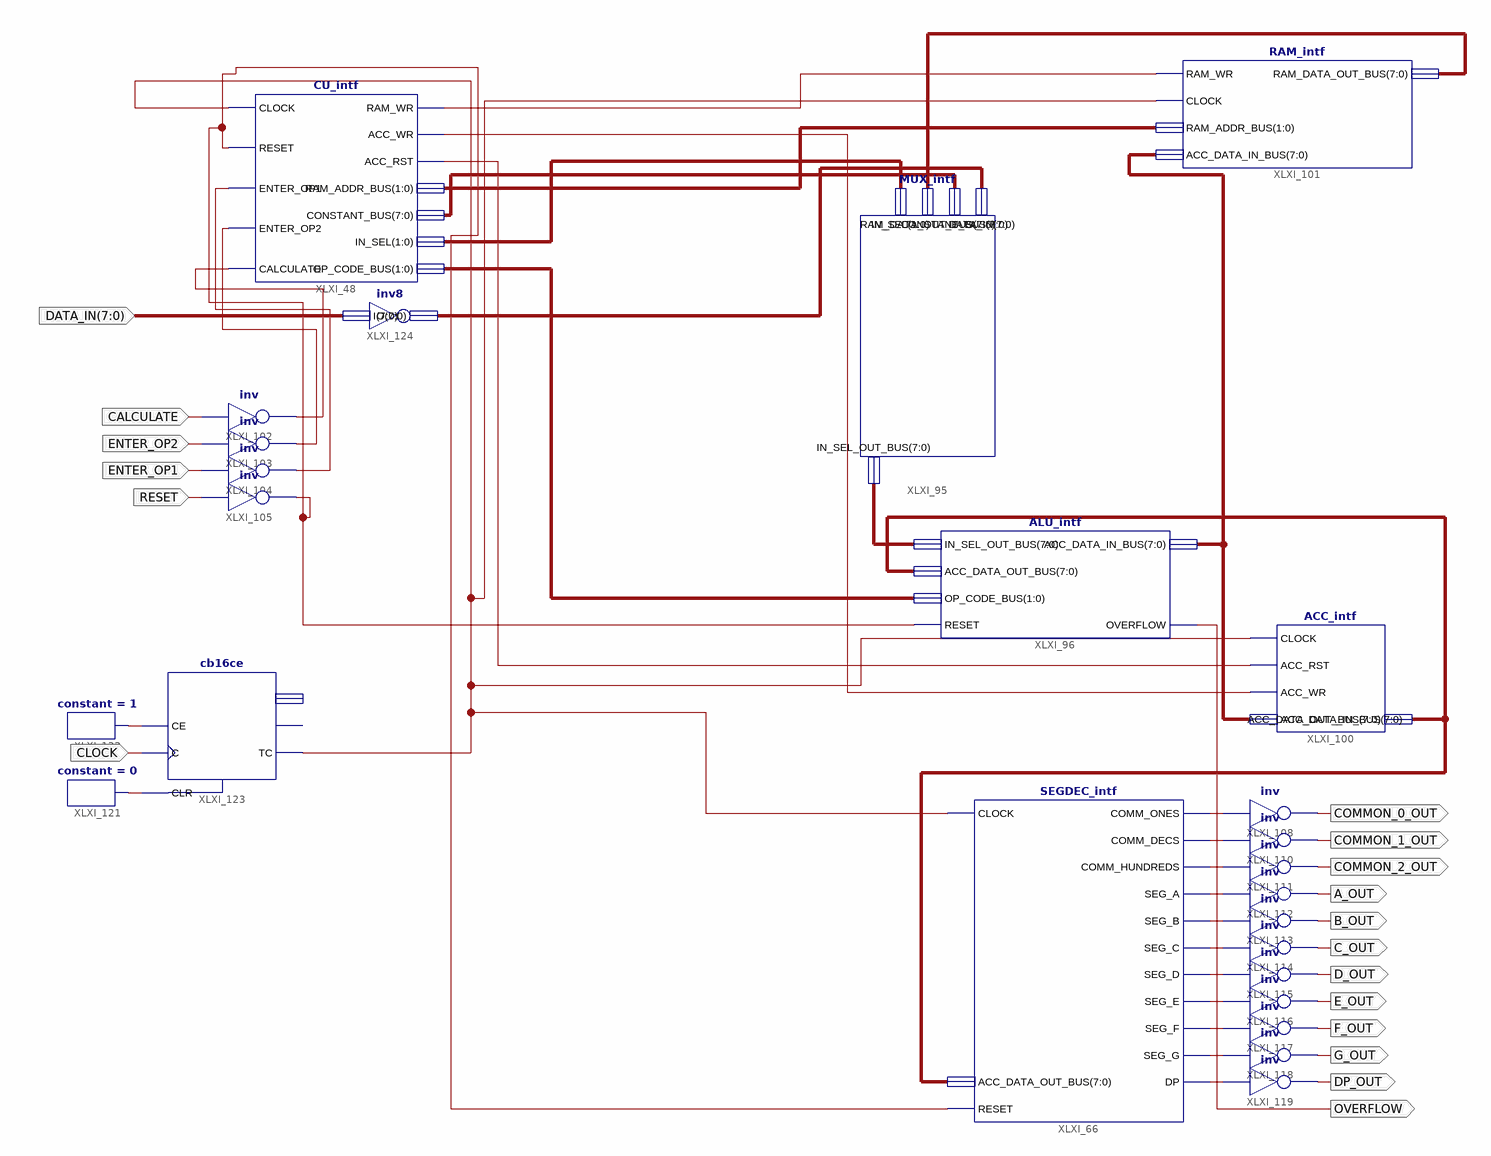
[diagram p0: schematic sheet 1]
// Xilinx ISE schematic TopLevel.sch (spartan3a) as structural Verilog: 25 symbols, 18 ports
module TopLevel (
  input  CALCULATE,
  input  ENTER_OP2,
  input  ENTER_OP1,
  input  RESET,
  input  CLOCK,
  input  [7:0] DATA_IN,
  output COMMON_0_OUT,
  output COMMON_1_OUT,
  output COMMON_2_OUT,
  output A_OUT,
  output B_OUT,
  output C_OUT,
  output D_OUT,
  output E_OUT,
  output F_OUT,
  output G_OUT,
  output DP_OUT,
  output OVERFLOW
);

  wire XLXN_223, XLXN_242, XLXN_243, XLXN_251, XLXN_256, XLXN_257, XLXN_261, XLXN_263, XLXN_265, XLXN_267,
       XLXN_269, XLXN_271, XLXN_273, XLXN_275, XLXN_277, XLXN_279, XLXN_280, XLXN_283, XLXN_284, XLXN_285,
       XLXN_288;
  wire [1:0] XLXN_224, XLXN_234, XLXN_235;
  wire [7:0] XLXN_213, XLXN_240, XLXN_246, XLXN_248, XLXN_249, XLXN_304;

  CU_intf XLXI_48 (
    .CLOCK(XLXN_288), .RESET(XLXN_261), .ENTER_OP1(XLXN_257), .ENTER_OP2(XLXN_256), .CALCULATE(XLXN_251),
    .RAM_WR(XLXN_223), .ACC_WR(XLXN_242), .ACC_RST(XLXN_243), .RAM_ADDR_BUS(XLXN_224),
    .CONSTANT_BUS(XLXN_240), .IN_SEL(XLXN_234), .OP_CODE_BUS(XLXN_235));
  SEGDEC_intf XLXI_66 (
    .CLOCK(XLXN_288), .RESET(XLXN_261), .ACC_DATA_OUT_BUS(XLXN_246), .COMM_ONES(XLXN_263),
    .COMM_DECS(XLXN_265), .COMM_HUNDREDS(XLXN_267), .SEG_A(XLXN_269), .SEG_B(XLXN_271), .SEG_C(XLXN_273),
    .SEG_D(XLXN_275), .SEG_E(XLXN_277), .SEG_F(XLXN_279), .SEG_G(XLXN_280), .DP(XLXN_283));
  MUX_intf XLXI_95 (
    .DATA_IN(XLXN_304), .CONSTANT_BUS(XLXN_240), .RAM_DATA_OUT_BUS(XLXN_249), .IN_SEL(XLXN_234),
    .IN_SEL_OUT_BUS(XLXN_213));
  ACC_intf XLXI_100 (
    .CLOCK(XLXN_288), .ACC_RST(XLXN_243), .ACC_WR(XLXN_242), .ACC_DATA_IN_BUS(XLXN_248),
    .ACC_DATA_OUT_BUS(XLXN_246));
  RAM_intf XLXI_101 (
    .RAM_WR(XLXN_223), .CLOCK(XLXN_288), .RAM_ADDR_BUS(XLXN_224), .ACC_DATA_IN_BUS(XLXN_248),
    .RAM_DATA_OUT_BUS(XLXN_249));
  not XLXI_102 (XLXN_251, CALCULATE);
  not XLXI_103 (XLXN_256, ENTER_OP2);
  not XLXI_104 (XLXN_257, ENTER_OP1);
  not XLXI_105 (XLXN_261, RESET);
  not XLXI_108 (COMMON_0_OUT, XLXN_263);
  not XLXI_110 (COMMON_1_OUT, XLXN_265);
  not XLXI_111 (COMMON_2_OUT, XLXN_267);
  not XLXI_112 (A_OUT, XLXN_269);
  not XLXI_113 (B_OUT, XLXN_271);
  not XLXI_114 (C_OUT, XLXN_273);
  not XLXI_115 (D_OUT, XLXN_275);
  not XLXI_116 (E_OUT, XLXN_277);
  not XLXI_117 (F_OUT, XLXN_279);
  not XLXI_118 (G_OUT, XLXN_280);
  not XLXI_119 (DP_OUT, XLXN_283);
  constant #(.CValue("0")) XLXI_121 (.O(XLXN_284));
  constant #(.CValue("1")) XLXI_122 (.O(XLXN_285));
  cb16ce XLXI_123 (.C(CLOCK), .CE(XLXN_285), .CLR(XLXN_284), .TC(XLXN_288));  // open: CEO, Q
  ALU_intf XLXI_96 (
    .IN_SEL_OUT_BUS(XLXN_213), .ACC_DATA_OUT_BUS(XLXN_246), .OP_CODE_BUS(XLXN_235),
    .ACC_DATA_IN_BUS(XLXN_248), .RESET(XLXN_261), .OVERFLOW(OVERFLOW));
  inv8 XLXI_124 (.I(DATA_IN), .O(XLXN_304));
endmodule
